# EAGLE design Weather Station v2.2-wihtparts (EAGLE 8.7.1)

## Sheet 1 of 2
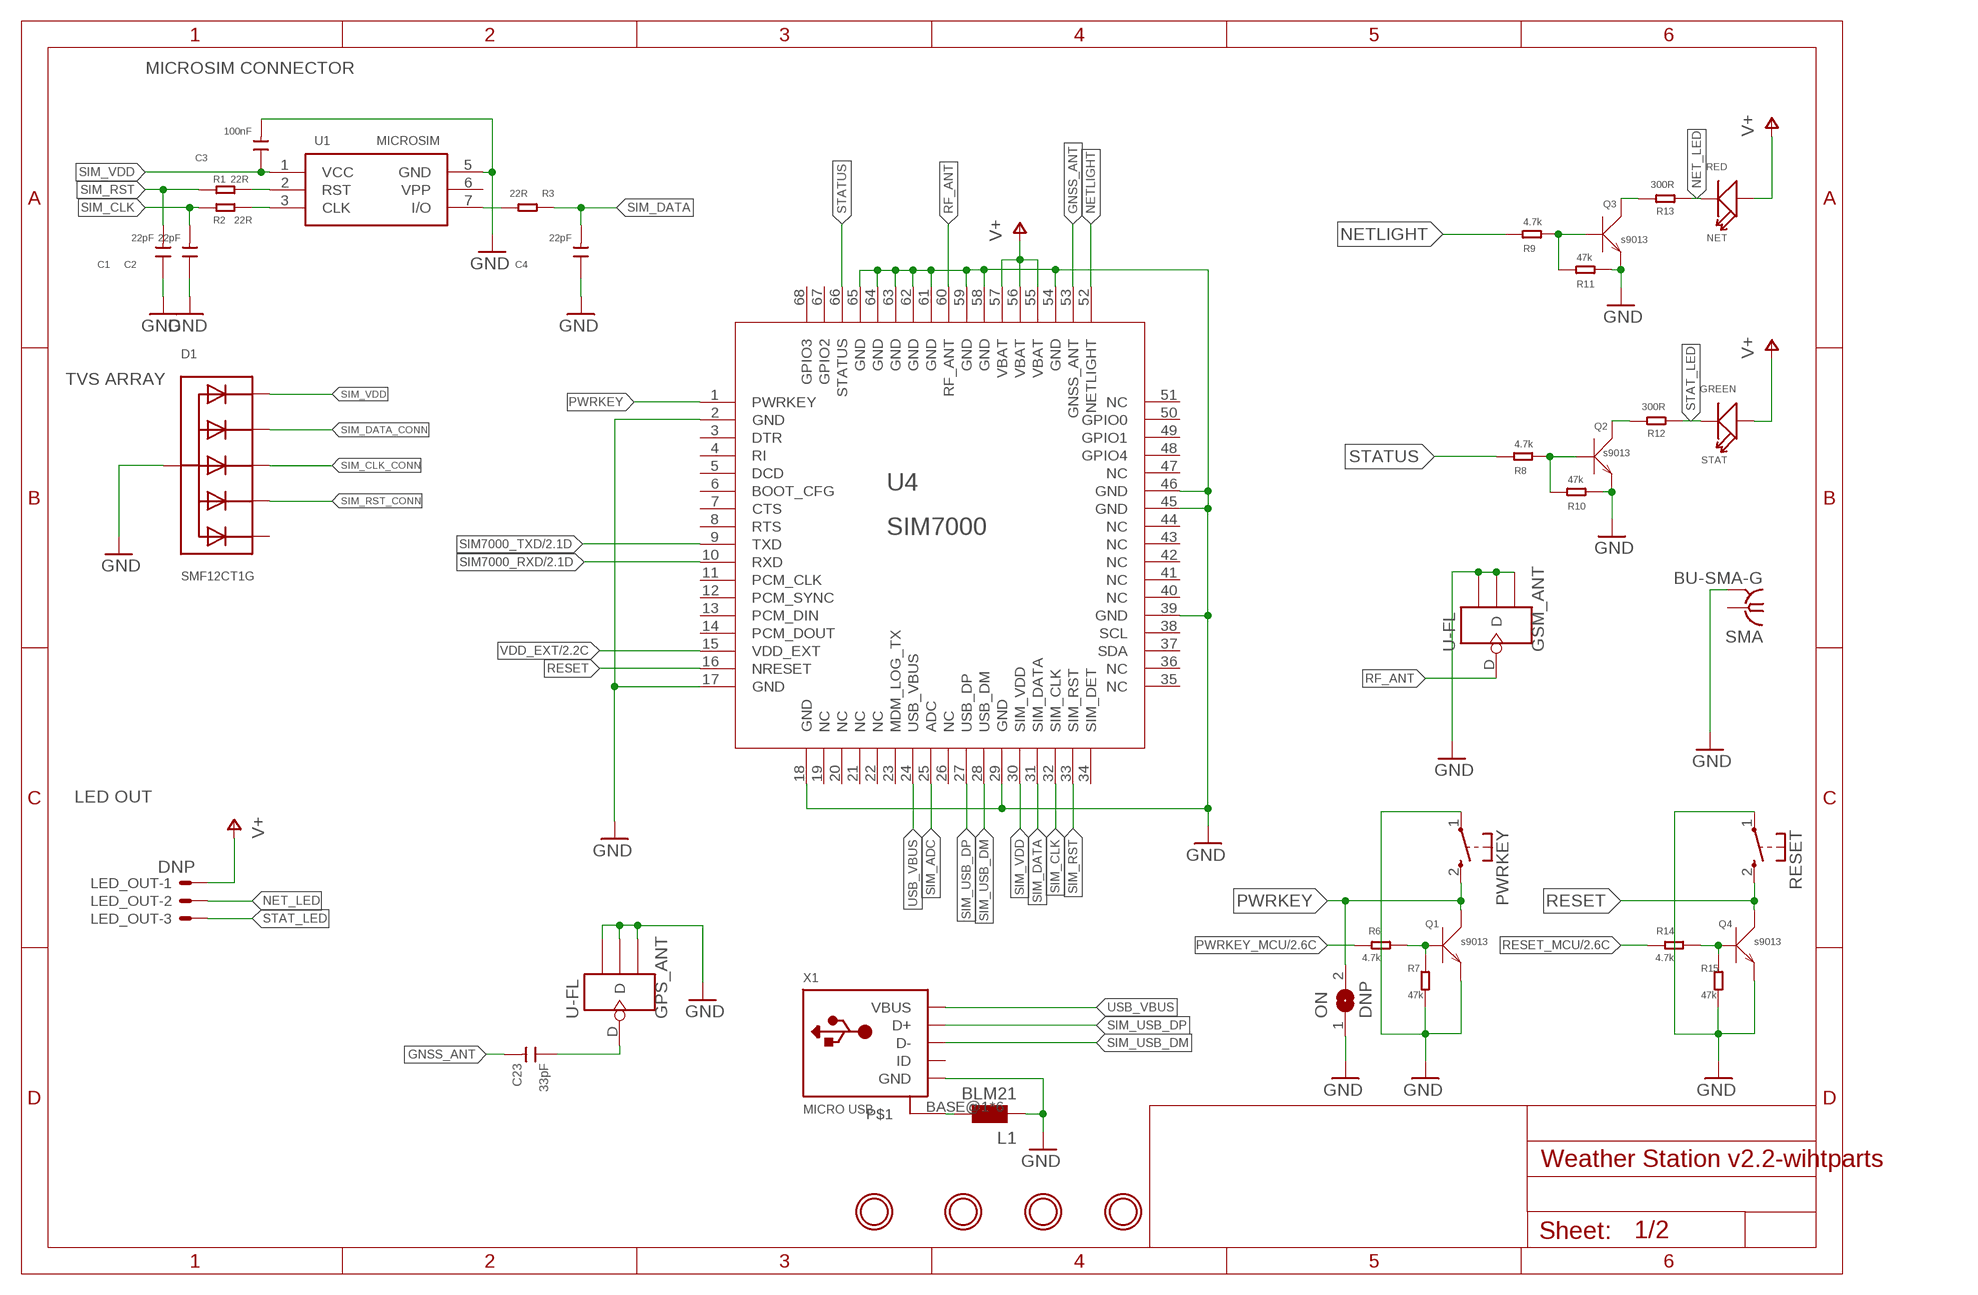
[diagram p0: schematic, sheet 1]

### Parts
$H1  DNP  MOUNTINGHOLE3.0THIN  [MOUNTINGHOLE_3.0_PLATEDTHIN]
$H2  DNP  MOUNTINGHOLE3.0THIN  [MOUNTINGHOLE_3.0_PLATEDTHIN]
$H3  DNP  MOUNTINGHOLE3.0THIN  [MOUNTINGHOLE_3.0_PLATEDTHIN]
$H4  DNP  MOUNTINGHOLE3.0THIN  [MOUNTINGHOLE_3.0_PLATEDTHIN]
C1  22pF  C-0805  [0805]
C2  22pF  C-0805  [0805]
C3  100nF  C-0805  [0805]
C4  22pF  C-0805  [0805]
C23  33pF  C-0805  [0805]
D1  SMF12CT1G  TVSARRAY_5LANE  [SOT363]
GPS_ANT  U-FL  ANTENNA-U-FL  [4P-U-FL]
GSM_ANT  U-FL  ANTENNA-U-FL  [4P-U-FL]
L1  BLM21  WE-CBF_0805  [0805]
LED_OUT  DNP  JST-XH-03-PIN  [JST-XH-03-WIRE]
NET  RED  LED-3MM  [LED-2P-2.54-3MM]
ON  DNP  SOLDERJUMPERREFLOW  [SOLDERJUMPER_REFLOW]
PWRKEY  KSS-2EG4430  [KSS-2EG4430]
Q1  s9013  TRANSISTOR-NPN-SOT23  [SOT23]
Q2  s9013  TRANSISTOR-NPN-SOT23  [SOT23]
Q3  s9013  TRANSISTOR-NPN-SOT23  [SOT23]
Q4  s9013  TRANSISTOR-NPN-SOT23  [SOT23]
R1  22R  R-0805  [0805]
R2  22R  R-0805  [0805]
R3  22R  R-0805  [0805]
R6  4.7k  R-0805  [0805]
R7  47k  R-0805  [0805]
R8  4.7k  R-0805  [0805]
R9  4.7k  R-0805  [0805]
R10  47k  R-0805  [0805]
R11  47k  R-0805  [0805]
R12  300R  R-0805  [0805]
R13  300R  R-0805  [0805]
R14  4.7k  R-0805  [0805]
R15  47k  R-0805  [0805]
RESET  KSS-2EG4430  [KSS-2EG4430]
SMA  BU-SMA-G  [BU-SMA-G]
STAT  GREEN  LED-3MM  [LED-2P-2.54-3MM]
U1  MICROSIM  [MICROSIM]
U4  SIM7000  [SIM7000]
X1  MICRO USB  USB_MICRO_20329_V2  [4UCONN_20329_V2]

### Nets
GND: C1.1 C2.1 C3.2 C4.1 D1.2(A) GPS_ANT.GND1 GPS_ANT.GND2 GPS_ANT.GND3 GSM_ANT.GND1 GSM_ANT.GND2 GSM_ANT.GND3 L1.1 ON.1 PWRKEY.1(P) Q1.2(E) Q2.2(E) Q3.2(E) Q4.2(E) R7.2 R10.2 R11.2 R15.2 RESET.1(P) SMA.2 SMA.3 SMA.4 SMA.5 U1.5(GND) U4.2(GND) U4.17(GND) U4.18(GND) U4.29(GND) U4.39(GND) U4.45(GND) U4.46(GND) U4.54(GND) U4.58(GND) U4.59(GND) U4.61(GND) U4.62(GND) U4.63(GND) U4.64(GND) U4.65(GND) X1.GND ; also sheet 2
GNSS_ANT [ANT]: C23.2 U4.53(GNSS_ANT)
N$1: Q4.1(B) R14.2 R15.1
N$3: Q2.3(C) R12.2
N$8: Q2.1(B) R8.2 R10.1
N$16: Q3.3(C) R13.2
N$18: Q3.1(B) R9.2 R11.1
N$19 [ANT]: C23.1 GPS_ANT.D
N$29: L1.2 X1.BASE@1 X1.BASE@2 X1.SPRT@1 X1.SPRT@2 X1.SPRT@3 X1.SPRT@4
N$36: Q1.1(B) R6.2 R7.1
NET_LED: LED_OUT.2 NET.K(-) R13.1
NETLIGHT: R9.1 U4.52(NETLIGHT)
PWRKEY: ON.2 PWRKEY.2(S) Q1.3(C) U4.1(PWRKEY)
PWRKEY_MCU: R6.1 ; also sheet 2
RESET: Q4.3(C) RESET.2(S) U4.16(NRESET)
RESET_MCU: R14.1 ; also sheet 2
RF_ANT [ANT]: GSM_ANT.D U4.60(RF_ANT)
SIM7000_RXD: U4.10(RXD) ; also sheet 2
SIM7000_TXD: U4.9(TXD) ; also sheet 2
SIM_ADC: U4.25(ADC)
SIM_CLK: C2.2 R2.2 U4.32(SIM_CLK)
SIM_CLK_CONN: D1.4(C3) R2.1 U1.3(CLK)
SIM_DATA: C4.2 R3.1 U4.31(SIM_DATA)
SIM_DATA_CONN: D1.3(C2) R3.2 U1.7(I/O)
SIM_RST: C1.2 R1.2 U4.33(SIM_RST)
SIM_RST_CONN: D1.5(C4) R1.1 U1.2(RST)
SIM_USB_DM: U4.28(USB_DM) X1.D-
SIM_USB_DP: U4.27(USB_DP) X1.D+
SIM_VDD: C3.1 D1.1(C1) U1.1(VCC) U4.30(SIM_VDD)
STAT_LED: LED_OUT.3 R12.1 STAT.K(-)
STATUS: R8.1 U4.66(STATUS)
USB_VBUS: U4.24(USB_VBUS) X1.VBUS
V+: LED_OUT.1 NET.A(+) STAT.A(+) U4.55(VBAT) U4.56(VBAT) U4.57(VBAT) ; also sheet 2
VDD_EXT: U4.15(VDD_EXT) ; also sheet 2
Unconnected: D1.6(C5) SMA.1 U1.6(VPP) U4.3(DTR) U4.4(RI) U4.5(DCD) U4.6(BOOT_CFG) U4.7(CTS) U4.8(RTS) U4.11(PCM_CLK) U4.12(PCM_SYNC) U4.13(PCM_DIN) U4.14(PCM_DOUT) U4.19(NC) U4.20(NC) U4.21(NC) U4.22(NC) U4.23(MDM_LOG_TX) U4.26(NC) U4.34(SIM_DET) U4.35(NC) U4.36(NC) U4.37(SDA) U4.38(SCL) U4.40(NC) U4.41(NC) U4.42(NC) U4.43(NC) U4.44(NC) U4.47(NC) U4.48(GPIO4) U4.49(GPIO1) U4.50(GPIO0) U4.51(NC) X1.ID

### Notes on the sheet
- MICROSIM CONNECTOR
- TVS ARRAY
- LED OUT

## Sheet 2 of 2
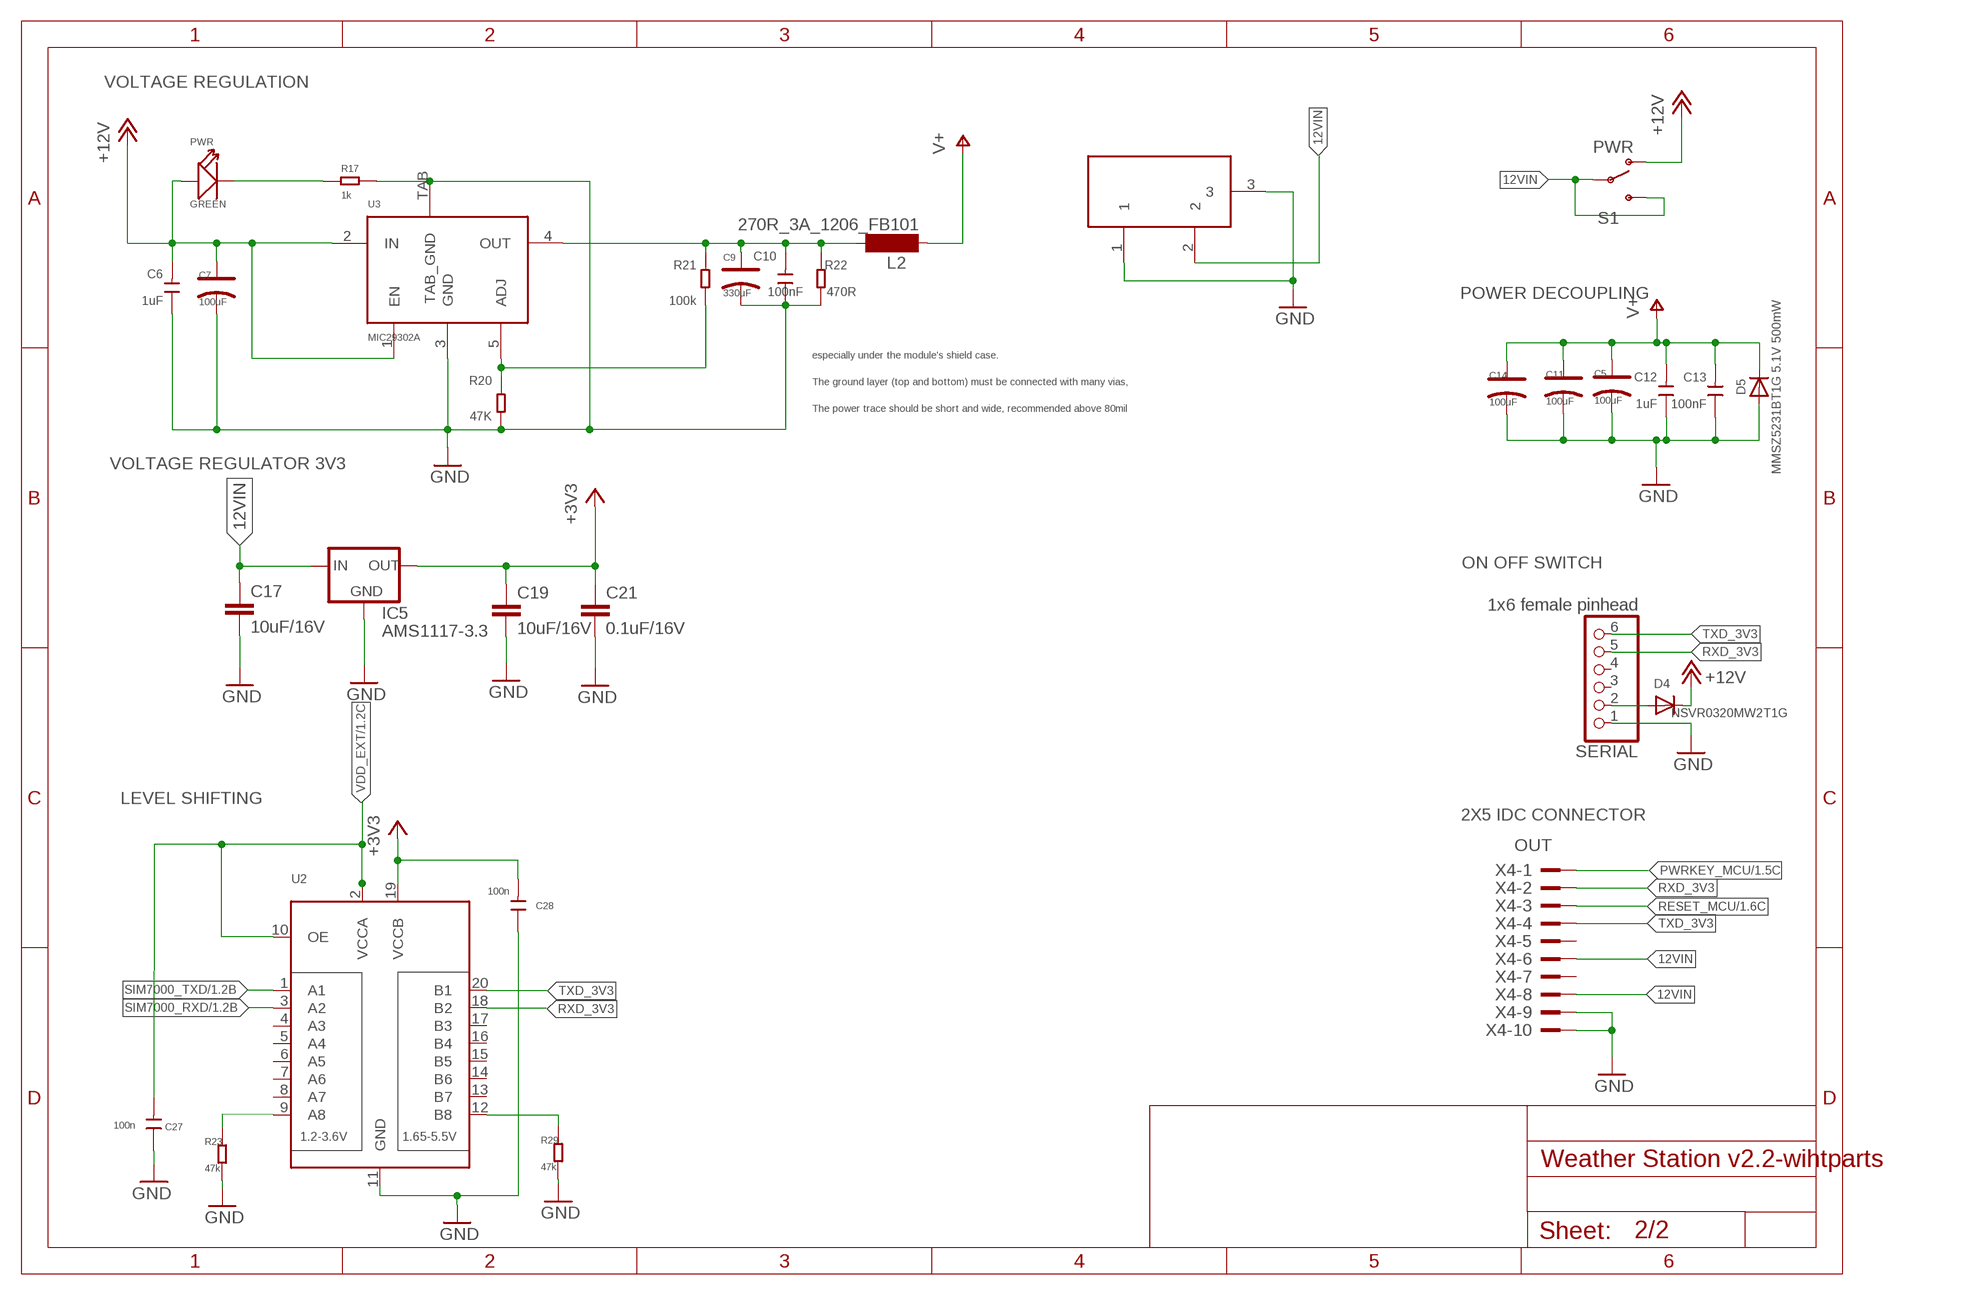
[diagram p1: schematic, sheet 2]

### Parts
C5  100uF  006-CAP_AVX_D  [AVX_D]
C6  1uF  C-0805  [0805]
C7  100uF  006-CAP_AVX_D  [AVX_D]
C8  DC21MMX  [DC-21MM]
C9  330uF  006-CAP_AVX_D  [AVX_D]
C10  100nF  C-0805  [0805]
C11  100uF  006-CAP_AVX_D  [AVX_D]
C12  1uF  C-0805  [0805]
C13  100nF  C-0805  [0805]
C14  100uF  006-CAP_AVX_D  [AVX_D]
C17  10uF/16V  C-EUC0805K  [C0805K]
C19  10uF/16V  C-EUC0805K  [C0805K]
C21  0.1uF/16V  C-EUC0805K  [C0805K]
C27  100n  C-0805  [0805]
C28  100n  C-0805  [0805]
D4  NSVR0320MW2T1G  DIODESOD-323  [SOD-323]
D5  MMSZ5231BT1G 5.1V 500mW  DIODESOD-123  [SOD-123]
IC5  AMS1117-3.3  LM1117  [SOT223]
L2  270R_3A_1206_FB101  SM-1206  [SM-1206]
PWR  GREEN  007-LED0805  [D0805]
R17  1k  R-0805  [0805]
R20  47K  R-0805  [0805]
R21  100k  R-0805  [0805]
R22  470R  R-0805  [0805]
R23  47k  R-0805  [0805]
R29  47k  R-0805  [0805]
S1  PWR  SWITCH-SPDT  [SWITCH-SPDT-CUSTOM]
SERIAL  1x6 female pinhead  PINHD-1X6  [1X06]
U2  TXB0108PWR  [TSSOP20]
U3  MIC29302A  [TO-263A]
X4  OUT  2510-  [PAK100/2500-10]

### Nets
12VIN: C8.2 C17.1 IC5.3(IN) S1.2(P) S1.3(S) X4.6 X4.8
+3V3: C19.1 C21.1 C28.2 IC5.2(OUT) U2.19(VCCB)
+12V: C6.2 C7.+ D4.C PWR.+ S1.1(O) U3.1(EN) U3.2(IN)
GND: C5.- C6.1 C7.- C8.1 C8.3 C9.- C10.1 C11.- C12.1 C13.1 C14.- C17.2 C19.2 C21.2 C27.1 C28.1 D5.A IC5.1(GND) R17.2 R20.1 R22.1 R23.2 R29.2 SERIAL.1 U2.11(GND) U3.3(GND) U3.TAB(TAB_GND) X4.9 X4.10 ; also sheet 1
N$2: R20.2 R21.1 U3.5(ADJ)
N$7: R23.1 U2.9(A8)
N$12: D4.A SERIAL.2
N$14: R29.1 U2.12(B8)
N$53: PWR.- R17.1
PWRKEY_MCU: X4.1 ; also sheet 1
RESET_MCU: X4.3 ; also sheet 1
RXD_3V3: SERIAL.5 U2.18(B2) X4.2
SIM7000_RXD: U2.3(A2) ; also sheet 1
SIM7000_TXD: U2.1(A1) ; also sheet 1
TXD_3V3: SERIAL.6 U2.20(B1) X4.4
V+: C5.+ C11.+ C12.2 C13.2 C14.+ D5.C L2.1 ; also sheet 1
VDD_EXT: C27.2 U2.2(VCCA) U2.10(OE) ; also sheet 1
VOUT: C9.+ C10.2 L2.2 R21.2 R22.2 U3.4(OUT)
Unconnected: SERIAL.3 SERIAL.4 U2.4(A3) U2.5(A4) U2.6(A5) U2.7(A6) U2.8(A7) U2.13(B7) U2.14(B6) U2.15(B5) U2.16(B4) U2.17(B3) X4.5 X4.7

### Notes on the sheet
- VOLTAGE REGULATION
- POWER DECOUPLING
- especially under the module's shield case.
- The ground layer (top and bottom) must be connected with many vias,
- The power trace should be short and wide, recommended above 80mil
- VOLTAGE REGULATOR 3V3
- ON OFF SWITCH
- LEVEL SHIFTING
- 2X5 IDC CONNECTOR

## Power pins joined to a net without a drawn wire
GPIO2: U4.67(GPIO2)
GPIO3: U4.68(GPIO3)

## Library data of the parts
$H1-$H4 = Adafruit SIM808 Breakout:MOUNTINGHOLE: Mounting Hole For #2 screws (0.086"/2.18mm width, 0.094"/2.4mm hole) use 2.5mm; BOM: EXCLUDE; OC_NEWARK: unknown
C1 C2 C4 = Discrete:C*: Ceramic Capacitors; MF: KEMET; MPN: C0402C220J5GACTU; OC_NEWARK: 03C3047
C3 C6 = Discrete:C*: Ceramic Capacitors; MPN: 08053G105ZAT2A; OC_NEWARK: 13AC4500
C5 C7 C11 C14 = Discrete:006-CAP*: Electrolytic Capacitors,Tantalum Capacitors and Super Capacitors; MPN: TCJD107M025R0055; OC_NEWARK: 54Y8509
C8 = powersupply:DC21MM; MPN: FC681478; OC_NEWARK: 94X0662
C9 = Discrete:006-CAP*: Electrolytic Capacitors,Tantalum Capacitors and Super Capacitors; MPN: TCJE337M016R0050; OC_NEWARK: 14AC5247
C10 = Discrete:C*: Ceramic Capacitors; MPN: MC0805B104M160CT; OC_NEWARK: 06R3744
C12 = Discrete:C*: Ceramic Capacitors; MPN: GRM21BF51C106ZE15L; OC_NEWARK: 03AC2713
C13 = Discrete:C*: Ceramic Capacitors; MPN: 08055A330JAT2A; OC_NEWARK: 04X9387
C17 C19 C21 = rcl:C-EU: CAPACITOR, European symbol
C23 C27 C28 = Discrete:C*: Ceramic Capacitors
D1 = Adafruit SIM808 Breakout:TVSARRAY_5LANE: Voltage Transient Suppressor Array SOT363 SMF05C - 100W 5V: Digikey - SMF05CT1GOSCT-ND; MPN: SMF12CT1G; OC_NEWARK: 13AC6244
D4 = Adafruit SIM808 Breakout:DIODE: Diode SMA Model Volts Amps Type Vf Ir Digikey # Notes SSA34-E3 40V 3A Schottky 480mV @ 3A 200uA @ 40V SSA34-E3/61TGITR-ND CDBA120-G 20V 1A Schottky 500mV @ 1A 500uA @ 20V 641-1014-6-ND REEL MBRA210 10V 2A Schottky 350mV @ 2A 700uA @ 10V MBRA210LT3 SOD-123 Model Volts Amps Type Vf Ir Order # Notes BAT54T1G 30V 200mA Schottky 800mV @ 200mA 2uA @ 25V BAT54T1GOSTR-ND B0530W 30V 500mA Schottky 430mV @ 500mA 130uA @ 30V B0530W-FDICT-ND REEL MBR120 20V 1A Schottky 340mV @ 1A MBR120VLSFT1GOSCT-ND SOD-323 Model Volts Amps Type Vf Ir Order # Notes PMEG2005EJ 20V 500mA Schottky 355mV @ 500mA 568-4110-1-ND ZLLS410 10V 570mA Schottky 380mV @ 570mA ZLLS410CT-ND 1N4148WS 75V 150mA Silicon/Simple 1V 1N4148WSFSCT-ND REEL SOD-523 Model Volts Amps Type Vf Ir Order # Notes BAT54XV2 30V 200mA Schottky 0.8V @ 100mA BAT54XV2CT-ND TB751S 30V 30mA Schottky RB751S-40TE61CT-ND SOT23-R/W (R = Solder Paste/Reflow Ovens, W = Hand-Soldering) Model Volts Amps Type Vf Ir Order # Notes BAT54FILM 40V 300mA Schottky 497-7162-1-ND POWERDI-5 Model Volts Amps Type Vf Ir Order # Notes PDS560 60V 5A Schottky 670mV @ 5A 150uA @ 60V PDS560DICT-ND; MPN: NSVR0320MW2T1G; OC_NEWARK: 81Y7028
D5 = Adafruit SIM808 Breakout:DIODE: Diode SMA Model Volts Amps Type Vf Ir Digikey # Notes SSA34-E3 40V 3A Schottky 480mV @ 3A 200uA @ 40V SSA34-E3/61TGITR-ND CDBA120-G 20V 1A Schottky 500mV @ 1A 500uA @ 20V 641-1014-6-ND REEL MBRA210 10V 2A Schottky 350mV @ 2A 700uA @ 10V MBRA210LT3 SOD-123 Model Volts Amps Type Vf Ir Order # Notes BAT54T1G 30V 200mA Schottky 800mV @ 200mA 2uA @ 25V BAT54T1GOSTR-ND B0530W 30V 500mA Schottky 430mV @ 500mA 130uA @ 30V B0530W-FDICT-ND REEL MBR120 20V 1A Schottky 340mV @ 1A MBR120VLSFT1GOSCT-ND SOD-323 Model Volts Amps Type Vf Ir Order # Notes PMEG2005EJ 20V 500mA Schottky 355mV @ 500mA 568-4110-1-ND ZLLS410 10V 570mA Schottky 380mV @ 570mA ZLLS410CT-ND 1N4148WS 75V 150mA Silicon/Simple 1V 1N4148WSFSCT-ND REEL SOD-523 Model Volts Amps Type Vf Ir Order # Notes BAT54XV2 30V 200mA Schottky 0.8V @ 100mA BAT54XV2CT-ND TB751S 30V 30mA Schottky RB751S-40TE61CT-ND SOT23-R/W (R = Solder Paste/Reflow Ovens, W = Hand-Soldering) Model Volts Amps Type Vf Ir Order # Notes BAT54FILM 40V 300mA Schottky 497-7162-1-ND POWERDI-5 Model Volts Amps Type Vf Ir Order # Notes PDS560 60V 5A Schottky 670mV @ 5A 150uA @ 60V PDS560DICT-ND; MF: ON SEMICONDUCTOR; MPN: MMSZ5231BT1G; OC_NEWARK: 83H7426
GPS_ANT = Connector:ANTENNA-U-FL
GSM_ANT = Connector:ANTENNA-U-FL; MF: FARNELL; MPN: U.FL-R-SMT(01); OC_NEWARK: 18K7517
IC5 = v-reg-3:LM1117
L1 = wuerth-elektronik:WE-CBF: SMD EMI Suppression Ferrite Beads - excellent anti-EMI properties - low DCR - impedances till 3000 ohms - rated current up to 6 A; MPN: BLM21AG121SN1D; OC_NEWARK: 73M9128
L2 = inductor-neosid:SM-1206: INDUCTOR SMD chip inductor; MPN: 742792121; OC_FARNELL: unknown; OC_NEWARK: 24AC5624
LED_OUT = Rembrandt Electronics - JST XH Connectors v1-0:JST-XH-03-PIN: JST XH Connector 2 Pin Wire to board connector. Pitch: 2,54 mm, (0.100") Number of pins: 3 Created by Rembrandt Electronics www.rembrandtelectronics.com; OC_NEWARK: unknown
NET = Discrete:LED*; MPN: 5988110107F; OC_NEWARK: 22M3026
ON = Adafruit111:SOLDERJUMPER: SMD Solder JUMPER Solder the two pads together to create a connection, or remove the solder to break it. REFLOW - Use this footprint for solder paste and reflow ovens. WAVE - Use this footprint for hand-soldering (larger pads). CLOSED - Has a trace between the two pads to ensure it is closed by default. The trace needs to be cut to disable the jumper, and can be closed again by creating a solder bridge between the two pads.; OC_NEWARK: unknown
PWR = Discrete:007-LED*; MPN: SML-LX0805SUGC-TR; OC_NEWARK: 19J8848
PWRKEY RESET = buttons:KSS-2EG4430: Size: 3x6mm Height: 5mm from PCB Rating: DC12v 50mA Travel: 0.25±0.10mm Operating Force: 180±50gf Return Force: 60gf min Contact resistance: 100m? max Insulation resistance: 100M? min Operating life?50,000 cycles; OC_NEWARK: unknown
Q1-Q4 = Discrete:TRANSISTOR-NPN*: NPN audion; MPN: DTC143TKAT146.; OC_NEWARK: 31AC8897
R1-R3 = Discrete:R*; MPN: CRM0805-FX-51R0ELF; OC_NEWARK: 17T4242
R6 R8 R9 R14 = Discrete:R*; MPN: MCWF08P4701FTL; OC_NEWARK: 06AC1578
R7 R10 R11 R15 = Discrete:R*; MF: VISHAY/DALE; MPN: CRCW080547K0FKEA; OC_NEWARK: 42K4553
R12 R13 = Discrete:R*; MPN: ERA-6AEB301V; OC_NEWARK: 01X1378
R17 = Discrete:R*; MF: VISHAY/DALE; MPN: CRCW08051K00FKTA; OC_NEWARK: 05F1507
R20 = Discrete:R*; MPN: CRCW080543K0JNEA.; OC_NEWARK: 15AC2572
R21 = Discrete:R*; MPN: CRCW0805100KJNEA; OC_NEWARK: 04M8142
R22 = Discrete:R*; MPN: ERA-6AEB471V; OC_NEWARK: 08N2174
R23 R29 = Discrete:R*
S1 = SparkFun-Electromechanical:SWITCH-SPDT: SPDT Switch Simple slide switch, Spark Fun Electronics SKU : COM-00102 DPDT SMT slide switch, AYZ0202, SWCH-08179; MPN: EG1201; OC_NEWARK: 15N7294
SERIAL = pinhead:PINHD-1X6: PIN HEADER; OC_NEWARK: unknown
SMA = con-coax:BU-SMA-G: FEMALE SMA CONNECTOR Radiall distributor RS 193-9117; MPN: 19-49-5-TGG; OC_FARNELL: unknown; OC_NEWARK: 26M6024
STAT = Discrete:LED*; MPN: SML-LX0805SUGC-TR; OC_NEWARK: 19J8848
U1 = GPRS+GSM+GPS Shield v1.0:MICROSIM; OC_NEWARK: unknown
U2 = adafruit:TXB0108PWR: 8-Bit Bi-Directional Level Shifter 1.2V-3.6V (VCCA) to 1.65V-5.5V (VCCB) bi-directional level shifter with auto direction sensing. Max data rate - VCCA 1.8V: 20Mbps (50ns), VCCA 3.3V: 100Mbps (10ns) Digikey: 296-21527-1-ND
U3 = ICs_v54:MIC29302; MPN: MIC29302WU-TR; OC_NEWARK: 72Y5332
U4 = ICs_v54:SIM7000
X1 = Adafruit SIM808 Breakout:USB: USB Connectors USBMINIB - Surface Mount Female Mini-B USB Connector 4UConnector: 06564; MPN: 10118193-0001LF; OC_NEWARK: 67T2259
X4 = con-3m:2510-: 3M (TM) Pak 100 4-Wall Header Source: 3M; MF: 3M; MPN: 30310-6002HB; OC_FARNELL: 9838244; OC_NEWARK: 81H9257

## Net classes
0 default: width 0.203 mm, drill 0.356 mm, clearance 0.152 mm
1 USB_DIFF: width 0.203 mm, drill 0.356 mm, clearance 0.152 mm
2 V+: width 2.032 mm, drill 0.356 mm, clearance 0.254 mm
3 ANT: width 1.016 mm, clearance 1.016 mm
4 GND: width 1.016 mm, clearance 0.152 mm

## Board
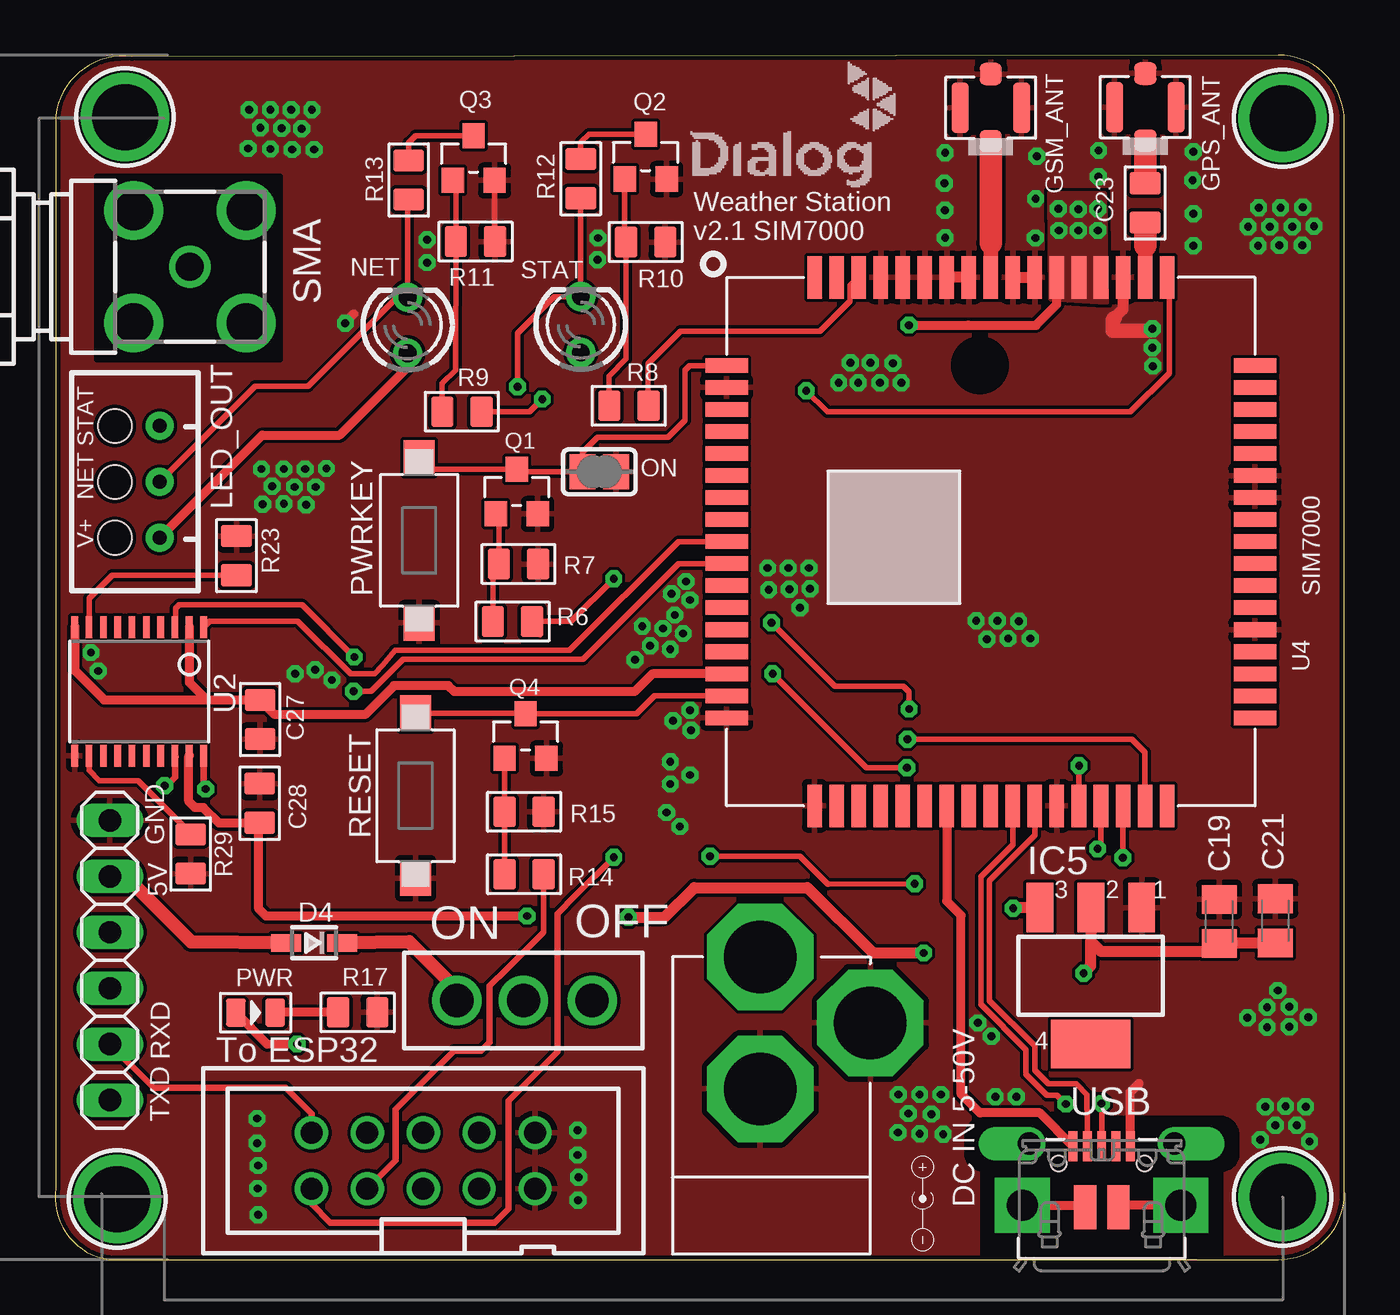
[diagram p2: board, top side]
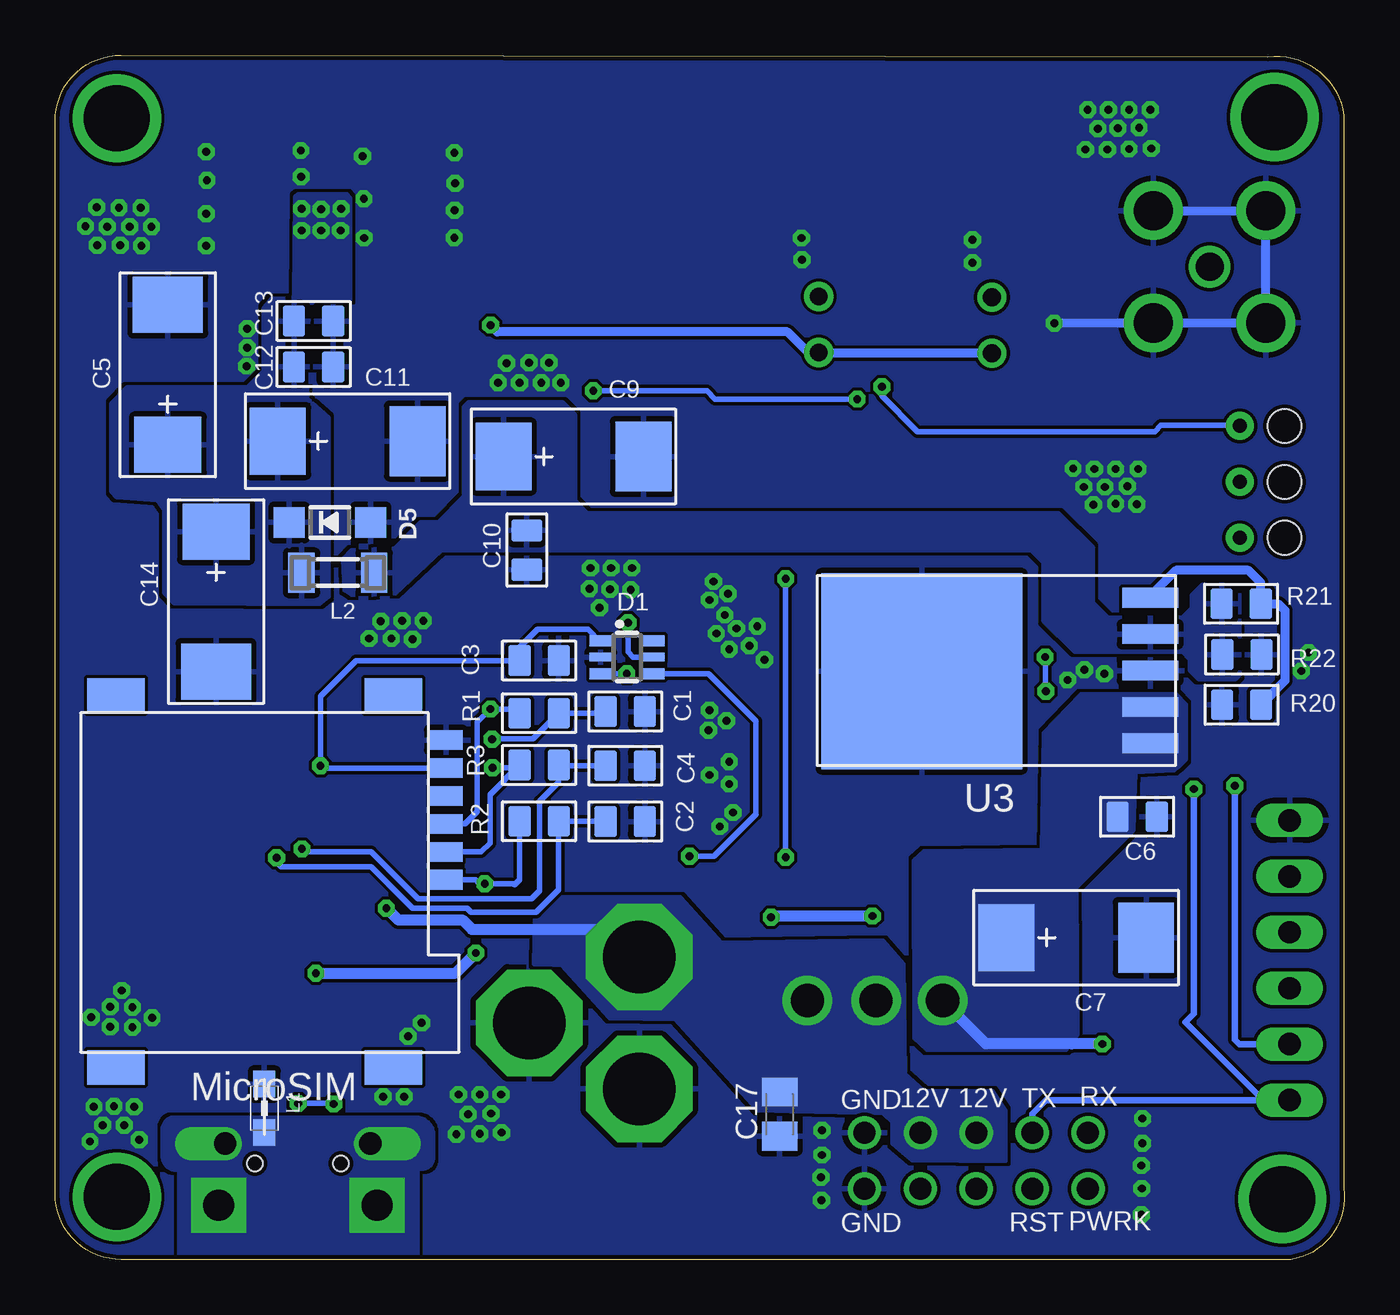
[diagram p3: board, bottom side, seen from below]

Size 58.56 x 54.68 mm. Coordinates in mm from the lower left corner, seen from the top.
Outline: 2.44,0 55.56,0 arc90 58.56,3 58.56,51.68 arc90 55.56,54.68 3.49,54.61 arc90 0.03,51.94 0.03,3.25 arc90 2.44,0
Copper layers (1*16): Top 0.035mm / dielectric 1.5mm / Bottom 0.035mm
Design rules "default *": minimum track width 8mil, minimum drill 14mil, track to track 6mil, track to pad 6mil, pad to pad 6mil, via to via 6mil, smd to smd 6mil, copper to edge 8mil, drill to drill 8mil, minimum pad ring 10mil, minimum via ring 8mil, stop-mask expansion 4mil, vias tented up to drill 14mil, thermal gap 10mil

### Footprints (pad centres in the part's own frame; a part is rotated, then mirrored left to right if it is on the bottom)
MOUNTINGHOLE_3.0_PLATEDTHIN = drill 3 pad 3.6: P$1 0,0
0805 = smd 1.016 x 1.397: 1 -0.889,0; 2 0.889,0
AVX_D = smd 2.54 x 3.048: + -3.175,0 | smd 2.54 x 3.175: - 3.175,0
DC-21MM = drill 3.302 pad 4.826 octagon: 1 -5.08,-3.353; 2 -0.076,-6.35; 3 -0.076,-0.356
C0805K = smd 1.3 x 1.6: 1 -1,0; 2 1,0
SOT363 = smd 0.5 x 1: 1 -0.75,-1.2; 3 0.75,-1.2; 4 0.75,1.2; 6 -0.75,1.2 | smd 0.4 x 1: 2 0,-1.2; 5 0,1.2
SOD-323 = smd 1.35 x 0.8: A 1.27,0; C -1.27,0
SOD-123 = smd 1.4 x 1.4: A 1.85,0; C -1.85,0
4P-U-FL = smd 1.016 x 1.016: D -1.524,0; GND3 1.524,0 | smd 2.286 x 0.762: GND1 0,1.397; GND2 0,-1.397
SOT223 = smd 1.219 x 2.235: 1 -2.311,-3.099; 2 0,-3.099; 3 2.311,-3.099 | smd 3.6 x 2.2: 4 0,3.099
0805' = smd 1.2 x 1: 1 -1.1,0; 2 1.1,0
SM-1206 = smd 1.2 x 1.8: 1 -1.65,0; 2 1.65,0
JST-XH-03-WIRE = drill 0.635 pad 1.27: 1 -2.54,-0.61; 2 0,-0.61; 3 2.54,-0.61 | hole 1.524: -2.54,1.422; 0,1.422; 2.54,1.422
LED-2P-2.54-3MM = drill 0.813: A -1.27,0; K 1.27,0
SOLDERJUMPER_REFLOW = smd 1.168 x 1.6: 1 -0.762,0; 2 0.762,0
D0805 = smd 0.889 x 1.27: + -0.889,0; - 0.889,0
KSS-2EG4430 = smd 1.6 x 1.4: 1 -3.75,0; 2 3.75,0
SOT23 = smd 1.016 x 1.143: 1 -0.95,-1.016; 2 0.95,-1.016; 3 0,1.016
SWITCH-SPDT-CUSTOM = drill 1.5: 1 0,3.023; 2 0,0; 3 0,-3.124
1X06 = drill 1.016 long: 1 -6.35,0; 2 -3.81,0; 3 -1.27,0; 4 1.27,0; 5 3.81,0; 6 6.35,0
BU-SMA-G = drill 1.27: 1 0,0 | drill 1.778: 2 -2.55,2.55; 3 2.55,2.55; 4 2.55,-2.55; 5 -2.55,-2.55
MICROSIM = smd 1.5 x 0.9: 1 -0.8,2.5; 2 -0.8,5.04; 3 -0.8,7.58; 5 -0.8,1.23; 6 -0.8,3.77; 7 -0.8,6.31 | smd 2.61 x 1.56: P$1 1.6,-0.8; P$2 14.2,-0.8; P$3 14.2,16.1; P$4 1.6,16.1
TSSOP20 = smd 0.305 x 0.991: 1 -2.925,-2.918; 2 -2.275,-2.918; 3 -1.625,-2.918; 4 -0.975,-2.918; 5 -0.325,-2.918; 6 0.325,-2.918; 7 0.975,-2.918; 8 1.625,-2.918; 9 2.275,-2.918; 10 2.925,-2.918; 11 2.925,2.918; 12 2.275,2.918; 13 1.625,2.918; 14 0.975,2.918; 15 0.325,2.918; 16 -0.325,2.918; 17 -0.975,2.918; 18 -1.625,2.918; 19 -2.275,2.918; 20 -2.925,2.918
TO-263A = smd 2.54 x 0.889: 1 5.842,-3.302; 2 5.842,-1.651; 3 5.842,0; 4 5.842,1.651; 5 5.842,3.302 | smd 9.12 x 8.89: TAB -4.531,-0.03
SIM7000 = smd 1.93 x 0.66: 1 -12,8; 2 -12,7; 3 -12,6; 4 -12,5; 5 -12,4; 6 -12,3; 7 -12,2; 8 -12,1; 9 -12,0; 10 -12,-1; 11 -12,-2; 12 -12,-3; 13 -12,-4; 14 -12,-5; 15 -12,-6; 16 -12,-7; 17 -12,-8; 35 12,-8; 36 12,-7; 37 12,-6; 38 12,-5; 39 12,-4; 40 12,-3; 41 12,-2; 42 12,-1; 43 12,0; 44 12,1; 45 12,2; 46 12,3; 47 12,4; 48 12,5; 49 12,6; 50 12,7; 51 12,8 | smd 0.66 x 1.93: 18 -8,-12; 19 -7,-12; 20 -6,-12; 21 -5,-12; 22 -4,-12; 23 -3,-12; 24 -2,-12; 25 -1,-12; 26 0,-12; 27 1,-12; 28 2,-12; 29 3,-12; 30 4,-12; 31 5,-12; 32 6,-12; 33 7,-12; 34 8,-12; 52 8,12; 53 7,12; 54 6,12; 55 5,12; 56 4,12; 57 3,12; 58 2,12; 59 1,12; 60 0,12; 61 -1,12; 62 -2,12; 63 -3,12; 64 -4,12; 65 -5,12; 66 -6,12; 67 -7,12; 68 -8,12
4UCONN_20329_V2 = smd 1 x 2: BASE@1 -0.75,-2; BASE@2 0.75,-2 | smd 0.4 x 1.35: D+ 0,0.775; D- -0.65,0.775; GND 1.3,0.775; ID 0.65,0.775; VBUS -1.3,0.775 | drill 1.016 pad 1.454 offset: SPRT@1 -3.3,0.9; SPRT@2 3.3,0.9 | drill 1.397 pad 2.5 square: SPRT@3 -3.6,-1.9; SPRT@4 3.6,-1.9 | hole 0.7: -1.95,0; 1.95,0
PAK100/2500-10 = drill 1 pad 1.422: 1 -5.08,-1.27; 2 -5.08,1.27; 3 -2.54,-1.27; 4 -2.54,1.27; 5 0,-1.27; 6 0,1.27; 7 2.54,-1.27; 8 2.54,1.27; 9 5.08,-1.27; 10 5.08,1.27

### Placement (x,y rotation side)
$H1  3.18,51.87 90 top
$H2  55.76,51.82 90 top
$H3  55.76,2.84 90 top
$H4  2.82,2.74 90 top
C1  32.67,24.88 180 bottom
C2  32.67,19.89 180 bottom
C3  36.57,27.2 0 bottom
C4  32.67,22.43 180 bottom
C5  53.44,40.17 90 bottom
C6  9.41,20.1 180 bottom
C7  12.18,14.62 0 bottom
C8  31.95,7.39 180 top
C9  35.02,36.46 0 bottom
C10  37.14,32.21 90 bottom
C11  45.27,37.16 0 bottom
C12  46.82,40.53 180 bottom
C13  46.82,42.61 180 bottom
C14  51.25,29.87 270 bottom
C17  25.65,6.6 270 bottom
C19  52.87,15.35 90 top
C21  55.42,15.38 90 top
C23  49.51,47.97 270 top
C27  9.31,24.52 90 top
C28  9.29,20.72 270 top
D1  32.58,27.35 270 bottom
D4  11.76,14.38 180 top
D5  46.08,33.47 0 bottom
GPS_ANT  49.52,52.32 90 top
GSM_ANT  42.5,52.3 90 top
IC5  47.04,12.88 180 top
L1  BLM21  [0805']  49.06,6.87 270 bottom
L2  45.72,31.18 0 bottom
LED_OUT  4.14,35.31 90 top
NET  16.01,42.42 90 top
ON  24.72,35.76 180 top
PWR  9.1,11.21 0 top
PWRKEY  16.54,32.65 90 top
Q1  20.97,34.87 0 top
Q2  26.82,50.07 0 top
Q3  19.01,50.01 0 top
Q4  21.37,23.77 0 top
R1  36.57,24.81 0 bottom
R2  36.57,19.9 0 bottom
R3  36.57,22.45 180 bottom
R6  20.77,28.97 180 top
R7  21.05,31.58 0 top
R8  26.06,38.76 180 top
R9  18.48,38.5 180 top
R10  26.82,46.19 0 top
R11  19.09,46.22 0 top
R12  23.88,49.07 90 top
R13  16.06,49.01 90 top
R14  21.3,17.5 180 top
R15  21.3,20.33 0 top
R17  13.75,11.22 0 top
R20  4.67,25.19 0 bottom
R21  4.69,29.77 180 bottom
R22  4.66,27.47 180 bottom
R23  8.24,31.96 90 top
R29  6.16,18.41 270 top
RESET  16.37,21.06 90 top
S1  21.27,11.76 90 top
SERIAL  2.49,13.59 270 top
SMA  6.13,45.07 180 top
STAT  23.88,42.45 90 top
U1  41.6,24.82 180 bottom
U2  3.82,25.8 180 top
U3  14.66,26.74 0 bottom
U4  42.5,32.59 0 top
X1  47.53,4.37 0 top
X4  16.72,4.49 0 top

### Tracks (layer width: path | path; a pad name or v marks a point on that pad's centre or on a via)
12VIN  (via drill 0.36)
  Top 0.508: IC5.3 43.57,15.98 43.51,15.93 v43.51,15.95
  Bottom 0.508: v43.51,15.95 42.98,15.42 40.06,15.42 39.63,14.99 33.27,14.99 C8.2
  pour Bottom (no thermals): 15.41,6.76 15.99,7.62 19.13,7.64 19.99,8.42 20.04,13.41 20.97,14.47 28.31,14.37 30.2,16.46 36.72,16.43 36.78,13.43 35.54,13.39 33.36,10.99 30.39,10.94 26.63,6.81 25.13,6.75 21.93,6.68 20.95,6.66 20.5,6.26 20.5,5.75 20.5,5.27 19.62,4.53 15.41,4.48
+3V3  (via drill 0.36)
  Top 0.406: U2.19 6.07,22.86 6.07,20.8 6.35,20.52 6.73,20.52 7.45,19.81 9.27,19.81 C28.2 9.25,19.79 9.25,15.93 9.58,15.6 v21.44,15.6
  Top 0.508: v26.04,15.54 27.69,15.54 29.04,16.89 34.17,16.89 37.14,13.92 v39.45,13.92 | C21.1 52.9,14.38 C19.1 52.52,14 47.5,14 47.04,14.46 | IC5.2 47.04,14.46 | v46.71,13 47.04,13.33 47.04,14.46
  Bottom 0.508: v21.44,15.6 26.04,15.6 v26.04,15.54 | v46.71,13 40.36,13 v39.45,13.92
+12V  (via drill 0.36)
  Top 0.406: PWR.+ 9.63,9.79 v10.99,9.79
  Top 0.61: D4.C 16.09,14.43 18.12,12.4 S1.1
  Bottom 0.508: v10.99,9.79 12.4,9.79 16.27,9.79 S1.1
  pour Bottom (no thermals): 7.23,25.19 7.67,25.67 11.94,25.63 13.64,23.9 13.71,18.57 19.09,18.51 19.53,18.12 19.5,10.07 18.94,9.56 12.64,9.56 12.16,10.22 12.19,16.91 9.61,19.52 9.52,22.15 7.74,22.23 7.57,22.4 7.23,22.74
GND  (via drill 0.36)
  Top 0.254: Q3.2 19.96,46.24 R11.2
  Top 0.406: v13.18,42.51 13.58,42.93 | 48.5,43.14 48.37,43 | X1.GND 48.83,7.6 49.23,8
  Top 0.508: U4.54 48.5,43.14 48.03,42.67 | U4.61 U4.62 | U4.59 U4.58
  Top 0.66: v49.84,42.27 49.74,42.16 48.03,42.16 48.03,42.67 48.13,42.77
  Bottom 0.406: SMA.2 10.01,42.52 v13.18,42.51 | SMA.2 SMA.3 | SMA.5 SMA.4 3.58,42.51 3.59,42.52 SMA.2
  other vias: 40.42,50.25 9.17,5.28 9.22,2.03 9.22,4.27 16.89,46.3 16.89,45.26 24.67,46.38 24.64,45.39 44.59,50.1 47.38,49.16 47.4,50.35 44.54,48.17 51.67,49.01 51.7,50.3 51.69,47.48 44.52,46.38 40.43,46.39 40.41,47.63 40.4,48.87 51.69,46.03 27.94,21.59 27.94,22.61 28.83,22 28.07,24.46 28.83,24.94 28.88,24.03 28.65,30.78 27.99,30.23 28.83,29.95 10.9,26.59 11.81,26.77 49.84,41.4 49.86,40.56 1.63,27.56 1.96,26.72 12.58,26.31 9.86,35.1 10.87,35.08 10.39,35.89 11.84,35.08 10.39,34.32 11.36,35.89 28.15,29.26 27.61,28.65 28.53,28.42 27.94,27.71 27.03,27.86 26.34,27.23 26.67,28.75 36.12,40.72 37.04,40.72 38.05,40.69 36.48,39.8 37.47,39.8 38.43,39.8 35.59,39.8 27.77,20.29 28.38,19.66 38.31,7.49 39.27,7.49 40.24,7.49 38.76,6.63 39.81,6.6 38.28,5.77 39.27,5.71 40.34,5.69 12.32,35.92 9.38,35.89 9.43,34.29 11.41,34.26 8.82,52.2 9.78,52.2 10.72,52.2 11.66,52.2 9.33,51.38 10.29,51.36 11.2,51.33 8.77,50.44 9.78,50.42 10.77,50.39 11.76,50.39 54.66,47.75 55.65,47.75 56.67,47.78 55.17,46.89 56.19,46.89 57.18,46.91 55.6,46.05 56.65,46.05 54.18,46.89 54.64,46.02 55.05,10.54 56.06,10.57 55.43,6.1 56.39,6.1 56.98,5.36 54.74,5.44 54.97,6.93 55.88,6.96 56.8,6.93 54.16,10.97 56.92,11 55.05,11.46 56.06,11.48 55.53,12.22 41.84,29.01 42.8,29.01 43.77,28.98 42.32,28.17 43.28,28.19 44.3,28.19 41.91,10.74 42.52,10.13 42.7,7.39 43.67,7.39 32.36,31.39 33.3,31.39 34.24,31.39 32.41,30.4 33.35,30.43 34.29,30.45 33.84,29.59 9.2,3.23 9.17,6.4 23.73,4.75 23.78,3.73 23.75,2.69 23.73,5.87
  pour Bottom (rank 6): -0.1,55.8 -0.1,-0.48 58.8,-1.02 59.41,55.27
  pour Top (rank 6): -0.02,55.7 -0.02,-0.58 58.8,-1.02 59.41,55.27
GNSS_ANT
  Top 0.66: 49.51,46.02 U4.53
  Top 1.016: C23.2 49.51,46.03 49.51,46.02
N$1
  Top 0.254: R14.2 | R14.2 R15.1 Q4.1
N$2
  Bottom 0.406: U3.5 8.82,30.13 7.66,31.29 4.36,31.29 3.8,30.74 R21.1 3.01,29.77 2.7,29.47 2.7,26.28 R20.2
N$3
  Top 0.254: Q2.3 24.25,51.09 23.88,50.72 R12.2
N$4
  cutout Top: 1.88,49.17 1.88,40.84 10.21,40.84 10.21,49.17
N$5
  cutout Top: 42.35,0 52.94,0 52.94,3.76 52.94,3.96 52.94,4.04 52.94,4.09 arc90 53.67,4.83 53.67,5.64 arc90 52.89,6.43 42.27,6.43 arc90 41.41,5.56 41.41,5.38 41.41,5.13 41.41,4.98 41.41,4.85 arc90 42.14,4.11 42.14,0
N$6
  cutout Top: 49.41,53.19 50.73,53.19 50.75,51.36 48.31,51.44 48.26,53.21
N$7
  Top 0.254: U2.9 1.55,30.02 2.6,31.07 R23.1
N$8
  Top 0.254: Q2.1 25.87,46.26 R10.1 25.94,40.89 25.15,40.11 25.15,38.78 R8.2
N$10
  cutout Top: 41.29,53.25 43.79,53.23 43.77,51.38 41.29,51.41
N$12
  Top 0.61: SERIAL.2 3.2,17.4 6.18,14.43 D4.A
N$14
  Top 0.254: U2.12 1.55,22.21 2.01,21.74 3.77,21.74 6.16,19.35 R29.1
N$16
  Top 0.254: Q3.3 16.38,51.03 16.06,50.71 R13.2
N$18
  Top 0.254: R11.1 | R11.1 18.21,48.85 Q3.1 | R11.1 18.18,40.38 17.58,39.78 17.58,38.5 R9.2
N$19
  Top 1.016: GPS_ANT.D C23.1
N$29
  Top 0.406: 46.94,2.47 X1.BASE@1 | X1.SPRT@4 48.38,2.47 X1.BASE@2 | X1.SPRT@3 46.94,2.47 | 46.94,2.47
  pour Bottom (no thermals): 42.12,4.14 42.12,-0.03 52.91,-0.03 52.91,4.09 53.01,4.09 arc90 53.65,4.72 53.65,5.89 arc90 53.11,6.43 43.03,6.43 42.22,6.43 arc90 41.41,5.61 41.41,4.83 41.41,4.67 arc90 41.94,4.14
N$36
  Top 0.254: Q1.1 20.16,33.72 R7.1 19.89,31.31 R6.2
N$53
  Top 0.406: R17.1 10.01,11.22 PWR.-
NET_LED
  Top 0.254: LED_OUT.2 9.1,39.65 11.48,39.65 15.53,43.69 NET.K 16.01,48.07 R13.1
NETLIGHT  (via drill 0.36)
  Top 0.254: R9.1 21.56,38.5 v22.13,39.06 | v34.12,39.45 35.08,38.48 48.85,38.48 50.62,40.25 50.62,44.59 U4.52
  Bottom 0.254: v22.13,39.06 28.58,39.06 28.96,39.45 v34.12,39.45
PWRKEY
  Top 0.254: PWRKEY.2 17.06,35.89 Q1.3 21.09,35.76 ON.2 23.96,36.65 24.64,37.34 27.84,37.34 28.6,38.1 28.6,40.39 28.81,40.59 U4.1
PWRKEY_MCU  (via drill 0.36)
  Top 0.254: 22.02,28.36 R6.1 23.44,28.97 v25.38,30.91 | v25.38,18.26 23.63,16.51
  Top 0.305: 23.63,16.51 22.81,15.7 22.81,9.42 20.6,7.21 20.6,2.31 19.97,1.68 12.5,1.68 11.64,2.53 X4.1
  Bottom 0.254: v25.38,18.26 v25.38,30.91
RESET
  Top 0.254: RESET.2 21.34,24.81 Q4.3 26.42,24.79 27.23,25.6 29.11,25.6 29.12,25.59 U4.16
RESET_MCU
  Top 0.254: 20.5,13.18 22.19,14.87 R14.1
  Top 0.305: X4.3 15.47,4.51 15.47,6.83 18.11,9.47 19.36,9.47 19.74,9.85 19.74,12.42 20.5,13.18
RF_ANT
  Top 0.66: 42.5,46.15 U4.60
  Top 1.016: GSM_ANT.D 42.5,46.15
RXD_3V3  (via drill 0.36)
  Top 0.254: U2.18 5.46,22.86
  Top 0.305: 5.46,22.86 5.49,22.83 | SERIAL.5 4.47,7.8 10.47,7.8 11.64,6.62 X4.2 | U2.18 5.45,21.9 5.06,21.51 v4.98,21.51
  Bottom 0.305: SERIAL.5 4.78,9.78 4.98,9.98 v4.98,21.51
SIM7000_RXD  (via drill 0.36)
  Top 0.254: U4.10 28.32,31.59 23.98,27.25 15.8,27.25 14.56,26.01 | U2.3 5.49,28.76 5.49,29.57 5.64,29.72 11.23,29.72 v13.59,27.36 | 14.56,26.01 14.56,25.98 | 14.56,26.01 14.35,25.81 v13.57,25.81
  Bottom 0.254: v13.59,27.36 13.59,25.83 v13.57,25.81
SIM7000_TXD
  Top 0.254: U4.9 28.31,32.59 23.37,27.66 15.45,27.66 14.89,26.97 14.51,26.59 13.41,26.59 11.03,28.98 7.01,28.98 U2.1
SIM_CLK  (via drill 0.36)
  Top 0.254: U4.32 48.5,18.24 v48.49,18.24
  Bottom 0.254: C2.2 33.57,19.9 R2.2 35.69,16.79 36.71,15.77 39.66,15.77 39.84,15.95 42.32,15.95 44.2,17.83 48.29,17.83 48.49,18.03 v48.49,18.24
SIM_CLK_CONN  (via drill 0.36)
  Top 0.254: v39.04,17.07 35.11,17.04 33.84,18.31 v29.75,18.31
  Bottom 0.254: D1.4 28.89,26.6 26.72,24.43 26.72,20.22 28.63,18.31 v29.75,18.31 | U1.3 39.47,17.24 39.3,17.07 39.07,17.07 | 39.07,17.07 v39.04,17.07 | R2.1 37.46,17.25 37.7,17.02 37.75,17.07 39.07,17.07
SIM_DATA  (via drill 0.36)
  Top 0.254: v47.35,18.64 47.5,18.79 U4.31
  Bottom 0.203: R3.1 35.69,22.18
  Bottom 0.254: C4.2 35.66,22.43 R3.1 35.69,21.67 36.55,20.8 36.55,16.74 36.91,16.38 42.07,16.38 44.2,18.52 47.25,18.52 47.35,18.62 v47.35,18.64
SIM_DATA_CONN  (via drill 0.36)
  Top 0.254: v32.59,26.59 36.86,22.33 v38.69,22.33
  Bottom 0.254: U1.7 39.21,18.51 38.81,18.9 38.81,21.1 R3.2 37.59,22.33 v38.69,22.33 | D1.3 32.68,26.6 32.67,26.62 32.62,26.62 v32.59,26.59
SIM_RST  (via drill 0.36)
  Top 0.254: v38.71,23.62 48.9,23.62 49.5,23.02 U4.33
  Bottom 0.254: C1.2 33.63,24.81 R1.2 36.85,23.65 38.69,23.65 v38.71,23.62
SIM_RST_CONN  (via drill 0.36)
  Top 0.254: v32.54,28.9 35.41,26.03 38.54,26.03 38.79,25.78 v38.79,24.99
  Bottom 0.254: 37.54,24.73 R1.1 37.65,24.99 v38.79,24.99 39.4,24.38 39.4,20.32 39.93,19.79 40.79,19.79 U1.2 | D1.5 32.31,27.35 32.54,27.58 v32.54,28.9
SIM_USB_DM
  Top 0.254: U4.28 44.5,19.26 42.45,17.21 42.45,11.76 44.5,9.7 44.5,8.58 45.11,7.98 46.38,7.98 46.87,7.49 46.87,6.81 46.88,6.8 X1.D-
SIM_USB_DP  (via drill 0.36)
  Top 0.254: v45.9,7.06 45.49,7.47 45.05,7.47 44.1,8.42 44.1,9.52 42.04,11.58 42.04,17.37 43.5,18.83 U4.27 | X1.D+ v47.53,7.08 v47.53,7.09
  Bottom 0.254: v47.53,7.09 45.93,7.09 v45.9,7.06
SIM_VDD  (via drill 0.36)
  Top 0.254: U4.30 v46.51,22.42
  Bottom 0.254: 37.54,27.27 C3.1 | D1.1 33.86,28.1 34.36,28.61 36.65,28.61 37.46,27.79 C3.1 | U1.1 46.41,22.32 v46.51,22.42 46.51,25.58 44.89,27.2 C3.1
STAT_LED  (via drill 0.36)
  Top 0.254: v21.01,39.62 21.01,42.06 22.67,43.72 STAT.K R12.1
  Bottom 0.254: v21.01,39.62 21.01,39.22 19.38,37.59 8.61,37.59 8.33,37.87 4.78,37.87 LED_OUT.3
STATUS
  Top 0.254: U4.66 36.11,44.2 36.11,43.51 34.73,42.14 28.4,42.14 26.93,40.67 26.93,38.78 R8.1
TXD_3V3  (via drill 0.36)
  Top 0.305: v6.84,21.36 6.75,21.45 U2.20
  Bottom 0.305: X4.4 14.18,6.62 13.57,7.24 SERIAL.6 3.69,7.24 7.22,10.77 6.84,11.15 v6.84,21.36
USB_VBUS
  Top 0.254: 40.52,20.58 U4.24
  Top 0.406: X1.VBUS 44.72,6.65 42.02,6.65 41.15,7.52 41.15,15.62 40.5,16.27 U4.24
V+  (via drill 0.36)
  Top 0.406: LED_OUT.1 9.42,37.43 12.92,37.43 16.01,40.52 NET.A | U4.57 45.5,43.36 44.55,42.41 41.66,42.41 41.47,42.42 v38.78,42.42
  Bottom 0.406: NET.A 23.85,41.15 STAT.A 24.36,41.18 25.3,42.12 38.48,42.12 v38.78,42.42
  other vias: 45.57,47.7 46.48,47.68 47.36,47.7 47.36,46.72 46.48,46.72 45.59,46.72
  pour Top (no thermals): 47.74,43.47 45.24,43.62 45.19,48.41 47.67,48.38
  pour Bottom: 46.13,38.23 46.13,30.1 46.56,29.74 53.14,29.79 53.6,30.28 53.6,34.01 53.93,34.47 55.76,34.62 56.01,34.87 56.01,38.86 55.27,39.6 49.81,39.6 49.08,40.34 49.08,43.18 48.7,43.64 47.83,43.61 47.7,43.71 47.65,48.26 47.53,48.36 45.34,48.39 45.16,48.18 45.16,43.59 46.69,43.64 47.04,43.28 47.12,39.09
VDD_EXT
  Top 0.254: 6.07,28.69 U2.2
  Top 0.406: U2.10 0.9,27.87 0.89,27.86 0.89,26.75 2.23,25.41 6.89,25.41 | 6.89,25.41 C27.2 9.98,24.74 14.08,24.74 15.4,26.06 17.86,26.06 18.14,25.78 26.32,25.78 27.13,26.59 U4.15 | U2.2 6.1,26.2 6.89,25.41
VOUT
  pour Bottom: 45.47,31.8 45.42,30.38 45.06,30.15 43.16,30.2 41.02,32.21 14.23,32.21 13.67,31.65 13.67,29.01 12.25,27.58 7.34,27.58 7.01,27.25 7.01,26.75 6.61,26.34 4.96,26.34 4.78,26.52 4.78,30.45 4.96,30.63 6.45,30.63 6.94,30.15 6.94,29.57 7.37,29.13 10.75,29.13 11.43,29.82 11.43,32.33 12.98,33.88 34.39,33.88 34.95,34.44 34.95,38.35 35.51,38.91 39.78,38.91 39.98,38.71 39.98,34.65 41.15,33.48 41.96,33.48 43.11,32.28 45.09,32.21

### Text on the board
tPlace: Weather Station / v2.1 SIM7000 | ON | OFF | DC IN 5-50V | To ESP32 | USB
bPlace: MicroSIM | RX | TX | 12V | 12V | GND | PWRK | RST | GND
tNames: STAT | NET | V+ | GND | 5V | RXD | TXD
bStop: '18/04/25